# Altium project MB1144C.PrjPCB (part 4 of 4)
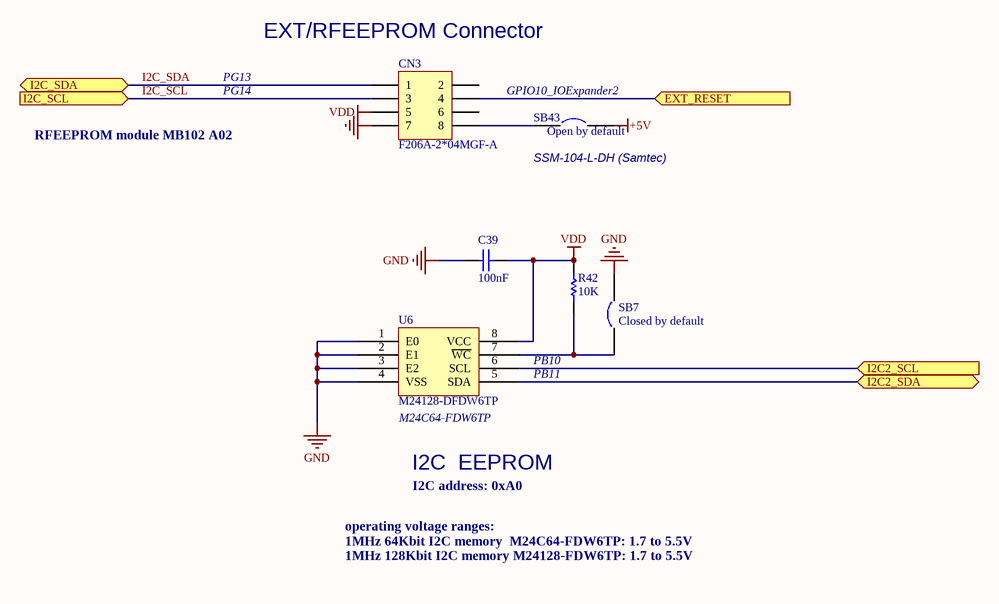
[diagram p25: RF_I2C_EEPROM.SchDoc]

## Nets that join several sheets
+1V8: Power (C107.1 TP16.1 U27.2 U27.4), Audio (6 pins)
+3V3: MotorControl (CN2.28 R14.2 R20.2), Extension connector (R44.1), USART_IrDA (10 pins), SWP_SmartCard_NFC (9 pins), USB_OTG_FS (R6.1 R8.1 R9.1), CAN (R70.1), peripherals (LD1.1 LD2.1 LD3.1 LD4.1), Power (9 pins), Audio (5 pins), LCD_TFT (9 pins)
+3V6: SRAM&Flash (C20.1 U5.G5), Power (5 pins)
+5V: MotorControl (CN2.25), ST_LINK (R169.2), SWP_SmartCard_NFC (C135.1 C138.1 U30.6), IDD_measurement (C75.1 R128.1 U15.4), USB_OTG_FS (U1.5), Power (11 pins), LCD_TFT (R223.1), RF_I2C_EEPROM (SB43.2)
D5V: Extension connector (CN6.28), ST_LINK (D7.1), Power (JP17.2)
E5V: ST_LINK (D5.1), Power (C100.1 JP17.8 L2.3)
GND: MCU (R100.2 R101.2 R102.2), LCD_Glass (R138.2 R139.2), IO_Expandor (10 pins), MCU2 (9 pins), SRAM&Flash (13 pins), MotorControl (26 pins), MicroSD (C90.2 CN18.6 CN18.9), QSPI (C44.2 U9.4), Extension connector (9 pins), JTAG&Trace (24 pins), ST_LINK (38 pins), USART_IrDA (19 pins), SWP_SmartCard_NFC (17 pins), STPMS2&PT100 (20 pins), IDD_measurement (12 pins), USB_OTG_FS (12 pins), Touch Sensing (C34.1 C37.1), CAN (10 pins), peripherals (9 pins), Power (60 pins), Audio (40 pins), LCD_TFT (27 pins), RF_I2C_EEPROM (7 pins)
U5V: ST_LINK (D6.1), USB_OTG_FS (R2.1), Power (JP17.6)
U5V_STLINK: ST_LINK (C143.2 U37.6 U37.7), Power (JP17.4)
VDD: LCD_Glass (R263.1 R264.1), IO_Expandor (9 pins), MCU2 (R57.2 R60.2 R96.2 SW1.1), SRAM&Flash (16 pins), MicroSD (7 pins), QSPI (C44.1 R74.1 U9.8), Extension connector (CN7.40), JTAG&Trace (8 pins), ST_LINK (8 pins), USART_IrDA (5 pins), SWP_SmartCard_NFC (C112.1 C119.1 U30.21), STPMS2&PT100 (5 pins), IDD_measurement (11 pins), CAN (C49.2 R46.2 U8.3), peripherals (10 pins), Power (JP2.2 JP12.1 TP5.1), Audio (6 pins), LCD_TFT (11 pins), RF_I2C_EEPROM (C39.2 CN3.5 R42.1 U6.8)
VDD_MCU: IDD_measurement (JP11.2 JP11.3), Power (21 pins)
VDDA: peripherals (CN10.2), Power (5 pins)
A0: MCU2 (U7.10), SRAM&Flash (U2.A3 U5.E2), Extension connector (CN6.25), LCD_TFT (U21.47)
A1: MCU2 (U7.11), SRAM&Flash (U2.A4 U5.D2), Extension connector (CN6.26), LCD_TFT (SB51.1 U21.37)
A2: MCU2 (U7.12), SRAM&Flash (U2.A5 U5.C2), Extension connector (CN6.32)
A3: MCU2 (U7.13), SRAM&Flash (U2.B3 U5.A2), Extension connector (CN6.34)
A4: MCU2 (U7.14), SRAM&Flash (U2.B4 U5.B2), Extension connector (CN6.37)
A5: MCU2 (U7.15), SRAM&Flash (U2.C3 U5.D3), Extension connector (CN6.38)
A6: MCU2 (U7.50), SRAM&Flash (U2.C4 U5.C3), Extension connector (CN7.17)
A7: MCU2 (U7.53), SRAM&Flash (U2.D4 U5.A3), Extension connector (CN7.18)
A8: MCU2 (U7.54), SRAM&Flash (U2.H2 U5.B6), Extension connector (CN7.16)
A9: MCU2 (U7.55), SRAM&Flash (U2.H3 U5.A6), Extension connector (CN7.14)
A10: MCU2 (U7.56), SRAM&Flash (U2.H4 U5.C6), Extension connector (CN7.12)
A11: MCU2 (U7.57), SRAM&Flash (U2.H5 U5.D6), Extension connector (CN7.11)
A12: MCU2 (U7.87), SRAM&Flash (U2.G3 U5.B7), Extension connector (CN6.13)
A13: MCU2 (U7.88), SRAM&Flash (U2.G4 U5.A7), Extension connector (CN6.12)
A14: MCU2 (U7.89), SRAM&Flash (U2.F3 U5.C7), Extension connector (CN6.14)
A15: MCU2 (U7.90), SRAM&Flash (U2.F4 U5.D7), Extension connector (CN6.10)
A16: LCD_Glass (CN14.30), SRAM&Flash (U2.E4 U5.E7)
A17: LCD_Glass (R151.1), SRAM&Flash (U2.D3 U5.B3)
A18: LCD_Glass (CN14.34), SRAM&Flash (U2.H1 U5.C4)
A19: LCD_Glass (R139.1 R150.1), SRAM&Flash (U2.G2 U5.D5)
A20: MCU (R84.1 R100.1), SRAM&Flash (U2.H6 U5.D4)
A21: MCU (R85.1 R101.1), SRAM&Flash (U2.E3 U5.C5)
A22: MCU (R86.1 R102.1), SRAM&Flash (U5.B8)
A23: LCD_Glass (R138.1 R149.1), SRAM&Flash (U5.C8)
BOOT0: MCU2 (JP8.1 R67.1 U7.138), Extension connector (CN7.20)
Comp2_INP: LCD_Glass (CN11.44), peripherals (JP7.3)
Comp2_OUT: LCD_Glass (CN11.14), peripherals (TP6.1)
D0: LCD_Glass (CN14.36), SRAM&Flash (U2.B6 U5.E3), LCD_TFT (U22.26)
D1: LCD_Glass (CN14.38), SRAM&Flash (U2.C5 U5.H3), LCD_TFT (U22.27)
D2: MCU (U7.114), SRAM&Flash (U2.C6 U5.E4), Extension connector (CN6.17), LCD_TFT (U22.29)
D3: MCU (U7.115), SRAM&Flash (U2.D5 U5.H4), Extension connector (CN6.16), LCD_TFT (U22.30)
D4: MCU (U7.58), SRAM&Flash (U2.E5 U5.H5), Extension connector (CN7.10), LCD_TFT (U22.32)
D5: MCU (U7.59), SRAM&Flash (U2.F5 U5.E5), Extension connector (CN7.9), LCD_TFT (U22.33)
D6: MCU (U7.60), SRAM&Flash (U2.F6 U5.H6), Extension connector (CN7.8), LCD_TFT (U22.35)
D7: MCU (U7.63), SRAM&Flash (U2.G6 U5.E6), Extension connector (CN7.7), LCD_TFT (U22.36)
D8: MCU (U7.64), SRAM&Flash (U2.B1 U5.F3), Extension connector (CN7.6), LCD_TFT (U22.37)
D9: MCU (U7.65), SRAM&Flash (U2.C1 U5.G3), Extension connector (CN7.5), LCD_TFT (U22.38)
D10: MCU (U7.66), SRAM&Flash (U2.C2 U5.F4), Extension connector (CN7.4), LCD_TFT (U22.40)
D11: MCU (U7.67), SRAM&Flash (U2.D2 U5.G4), Extension connector (CN7.3), LCD_TFT (U22.41)
D12: MCU (U7.68), SRAM&Flash (U2.E2 U5.F5), Extension connector (CN7.2), LCD_TFT (U22.43)
D13: LCD_Glass (CN14.24), SRAM&Flash (U2.F2 U5.G6), LCD_TFT (U22.44)
D14: LCD_Glass (CN14.26), SRAM&Flash (U2.F1 U5.F6), LCD_TFT (U22.46)
D15: LCD_Glass (CN14.28), SRAM&Flash (U2.G1 U5.G7), LCD_TFT (U22.47)
I2C_SCL: IO_Expandor (U32.4 U33.19), MCU2 (R60.1 R61.1), Audio (U29.H1), RF_I2C_EEPROM (CN3.3)
I2C_SDA: IO_Expandor (U32.5 U33.20), MCU2 (R57.1 R58.1), Audio (U29.F3), RF_I2C_EEPROM (CN3.1)
LCD_NE3: MCU2 (U7.125), Extension connector (CN6.21), LCD_TFT (SB49.1 U21.46)
LCDCOM0: MCU (U7.100), LCD_Glass (CN11.3)
LCDCOM1: MCU (U7.101), LCD_Glass (CN11.1)
LCDCOM2: MCU (U7.102), LCD_Glass (CN11.5)
LCDCOM3: MCU (U7.140), LCD_Glass (CN11.7)
LCDCOM4: LCD_Glass (CN14.7), MCU2 (U7.111)
LCDCOM5: LCD_Glass (CN14.5), MCU2 (U7.112)
LCDCOM6: LCD_Glass (CN14.3), MCU2 (U7.113)
LCDCOM7: MCU (U7.116), LCD_Glass (CN14.1)
LCDSEG0: MCU (R82.1), LCD_Glass (CN14.47)
LCDSEG1: MCU (R81.1), LCD_Glass (CN11.35)
LCDSEG2: MCU (R78.2), LCD_Glass (CN11.33)
LCDSEG3: MCU (R68.1), LCD_Glass (CN11.41)
LCDSEG4: MCU (R66.1), LCD_Glass (CN11.39)
LCDSEG5: MCU (R62.1), LCD_Glass (CN11.37)
LCDSEG6: MCU (R56.1), LCD_Glass (CN11.47)
LCDSEG7: MCU (U7.133), LCD_Glass (CN11.45), JTAG&Trace (RS1.9), ST_LINK (U24.6)
LCDSEG8: MCU (U7.134), LCD_Glass (CN11.43), JTAG&Trace (RS1.5), ST_LINK (U23.19)
LCDSEG9: MCU (U7.135), LCD_Glass (CN11.13)
LCDSEG10: MCU (R50.1), LCD_Glass (CN11.11)
LCDSEG11: MCU (R48.1), LCD_Glass (CN11.9)
LCDSEG12: MCU (R39.2), LCD_Glass (CN11.19)
LCDSEG13: MCU (R38.1), LCD_Glass (CN11.17)
LCDSEG14: MCU (U7.75), LCD_Glass (CN11.15)
LCDSEG15: MCU (U7.76), LCD_Glass (CN11.25)
LCDSEG16: MCU (U7.139), LCD_Glass (CN11.23)
LCDSEG17: MCU (U7.110), LCD_Glass (CN11.21), JTAG&Trace (RS1.7), ST_LINK (U23.17)
LCDSEG18: LCD_Glass (CN11.31), MCU2 (R97.1)
LCDSEG19: LCD_Glass (CN11.29), MCU2 (R98.1)
LCDSEG20: LCD_Glass (CN11.27), MCU2 (R99.1)
LCDSEG21: MCU (U7.137), LCD_Glass (CN14.9)
LCDSEG22: LCD_Glass (CN14.11), MCU2 (R65.1)
LCDSEG23: LCD_Glass (CN14.13), MCU2 (R64.1)
LCDSEG24: LCD_Glass (CN14.15), MCU2 (R36.1)
LCDSEG25: LCD_Glass (CN14.17), MCU2 (R33.1)
LCDSEG26: LCD_Glass (CN14.19), MCU2 (SB28.2 U7.98)
LCDSEG27: LCD_Glass (CN14.21), MCU2 (SB29.2 U7.99)
LCDSEG28: MCU (U7.77), LCD_Glass (CN14.23)
LCDSEG29: MCU (U7.78), LCD_Glass (CN14.25)
LCDSEG30: MCU (U7.79), LCD_Glass (CN14.27)
LCDSEG31: MCU (U7.80), LCD_Glass (CN14.29)
LCDSEG32: MCU (U7.81), LCD_Glass (CN14.31)
LCDSEG33: MCU (U7.82), LCD_Glass (CN14.33)
LCDSEG34: MCU (U7.85), LCD_Glass (CN14.35)
LCDSEG35: MCU (U7.86), LCD_Glass (CN14.37)
LCDSEG36: MCU (U7.141), LCD_Glass (CN14.39)
LCDSEG37: MCU (U7.142), LCD_Glass (CN14.41)
LCDSEG38: MCU (R103.2), LCD_Glass (CN14.43)
LCDSEG39: MCU (R104.2), LCD_Glass (CN14.45)
NetB3_1: IO_Expandor (U33.3), peripherals (B3.1 R248.1)
NetB3_2: IO_Expandor (U33.1), peripherals (B3.2 R246.2)
NetB3_3: IO_Expandor (U33.2), peripherals (B3.3 R247.1)
NetB3_4: IO_Expandor (U33.4), peripherals (B3.4 R249.1)
NetB3_6: IO_Expandor (U33.5), peripherals (B3.6 R250.1)
NetC1_2: MCU (SB32.1), MotorControl (C1.2 CN2.33)
NetC2_2: MCU (SB31.1), MotorControl (C2.2 CN2.34)
NetC3_1: MCU2 (SB17.1), MotorControl (C3.1 R7.2)
NetC4_2: MCU (SB35.1), MotorControl (C4.2 CN2.31 SB1.2)
NetC5_2: MCU (SB3.1), MotorControl (C5.2 CN2.30 R20.1)
NetC6_2: MCU (SB20.1), MotorControl (C6.2 R12.2)
NetC7_2: MCU2 (SB29.1), MotorControl (C7.2 CN2.1 R14.1)
NetC9_2: MCU2 (SB37.2), MotorControl (C9.2 CN2.29)
NetC10_2: MCU2 (SB42.1), MotorControl (C10.2 R17.1)
NetC11_1: MCU2 (SB16.1), MotorControl (C11.1 R13.2 R19.1)
NetC13_2: MCU2 (SB36.1), MotorControl (C13.2 R10.1)
NetC14_2: MCU2 (SB34.1), MotorControl (C14.2 R11.1)
NetC15_1: LCD_Glass (CN11.2 R108.2), USB_OTG_FS (6 pins)
NetC16_2: MCU2 (SB25.2), MotorControl (C16.2 R15.1)
NetC17_1: MCU (SB22.1), MotorControl (C17.1 R16.2)
NetC34_2: MCU2 (SB4.1), Touch Sensing (C34.2)
NetC37_2: MCU (SB6.1), Touch Sensing (C37.2)
NetC52_2: peripherals (C52.2 C53.1 R92.2), Power (U7.32)
NetC73_1: MCU (R69.2), IDD_measurement (C73.1 R122.2)
NetCN2_3: MCU2 (SB27.1), MotorControl (CN2.3)
NetCN2_5: MCU (SB19.1), MotorControl (CN2.5)
NetCN2_7: MCU2 (SB30.1), MotorControl (CN2.7)
NetCN2_9: MCU (SB15.1), MotorControl (CN2.9)
NetCN2_11: MCU2 (SB28.1), MotorControl (CN2.11)
NetCN2_13: MCU (SB13.1), MotorControl (CN2.13)
NetCN2_21: MCU2 (SB5.2), MotorControl (CN2.21)
NetCN2_23: MCU (SB11.1), MotorControl (CN2.23)
NetCN3_4: IO_Expandor (U33.12), RF_I2C_EEPROM (CN3.4)
NetCN11_4: LCD_Glass (CN11.4), MicroSD (R194.1)
NetCN11_6: LCD_Glass (CN11.6), USB_OTG_FS (R5.2)
NetCN11_8: LCD_Glass (CN11.8), CAN (R75.2)
NetCN11_16: LCD_Glass (CN11.16), SWP_SmartCard_NFC (CN13.4)
NetCN11_18: LCD_Glass (CN11.18 R108.1), SWP_SmartCard_NFC (CN13.6)
NetCN11_20: LCD_Glass (CN11.20 R109.1), SWP_SmartCard_NFC (CN23.6)
NetCN11_24: LCD_Glass (CN11.24), CAN (R76.1)
NetCN11_26: LCD_Glass (CN11.26), SWP_SmartCard_NFC (CN13.5)
NetCN11_28: LCD_Glass (CN11.28), STPMS2&PT100 (6 pins), Audio (JP14.3)
NetCN11_30: LCD_Glass (CN11.30), peripherals (R256.1)
NetCN11_32: LCD_Glass (CN11.32), Audio (U29.A9 U35.4 U36.4)
NetCN12_12: MCU (SB26.2), JTAG&Trace (CN12.12 U18.4)
NetCN12_18: MCU (SB38.2), JTAG&Trace (CN12.18 U19.3)
NetCN12_20: MCU (SB39.2), JTAG&Trace (CN12.20 U19.1)
NetCN13_1: USART_IrDA (JP15.6), SWP_SmartCard_NFC (CN13.1)
NetCN13_2: USART_IrDA (U10.13 U11.3 U12.7), SWP_SmartCard_NFC (CN13.2)
NetCN14_2: LCD_Glass (CN14.2), MicroSD (CN18.3 R178.2)
NetCN14_10: LCD_Glass (CN14.10), USART_IrDA (JP15.1 JP15.3 JP15.5 R158.1)
NetCN14_40: LCD_Glass (CN14.40), SRAM&Flash (U2.A1)
NetCN14_42: LCD_Glass (CN14.42), SRAM&Flash (U2.B2)
NetCN18_1: LCD_Glass (R142.1), MicroSD (CN18.1 R175.2)
NetCN18_2: LCD_Glass (R141.1), MicroSD (CN18.2 R176.2)
NetCN18_5: LCD_Glass (R140.1), MicroSD (CN18.5)
NetCN18_7: LCD_Glass (R147.1), MicroSD (CN18.7 R182.2)
NetCN18_8: LCD_Glass (R148.1), MicroSD (CN18.8 R185.2)
NetCN19_31: IO_Expandor (U32.16), LCD_TFT (CN19.31)
NetCN19_32: IO_Expandor (U32.13), LCD_TFT (CN19.32)
NetCN19_33: IO_Expandor (U32.1), LCD_TFT (CN19.33)
NetCN19_34: IO_Expandor (U32.15), LCD_TFT (CN19.34)
NetD4_2: MCU2 (D4.2), USART_IrDA (R93.1 U10.16)
NetJP19_1: LCD_Glass (R145.1), USB_OTG_FS (JP19.1)
NetLD6_2: LCD_Glass (R109.2), USB_OTG_FS (LD6.2 R8.2 U1.3)
NetR24_1: LCD_Glass (R146.1), STPMS2&PT100 (R24.1)
NetR32_2: MCU (SB10.2), SRAM&Flash (R32.2 U5.A4)
NetR34_1: MCU2 (R34.1), ST_LINK (R189.1), USART_IrDA (R119.2)
NetR35_1: MCU2 (R35.1), Audio (R199.2)
NetR37_1: MCU2 (SB2.1), Touch Sensing (R37.1)
NetR39_1: MCU (R39.1 SB3.2 U7.73), Touch Sensing (R40.1)
NetR53_2: MCU (R53.2), Audio (R205.2)
NetR54_2: MCU (R54.2), peripherals (R258.1)
NetR59_2: MCU2 (R59.2), USART_IrDA (U10.20)
NetR71_2: MCU (SB8.1), QSPI (R71.2)
NetR89_1: MCU2 (R89.1), Audio (R201.2)
NetR90_1: MCU2 (R90.1), Audio (R208.2)
NetR91_1: MCU2 (R91.1), IDD_measurement (R127.2 U14.12)
NetR104_1: MCU (R104.1 U7.2), JTAG&Trace (R154.2)
NetR105_1: MCU2 (R105.1), Audio (R198.2)
NetR106_1: MCU2 (R106.1), Audio (R222.1)
NetR107_1: LCD_Glass (R107.1), SWP_SmartCard_NFC (U30.24)
NetR137_1: LCD_Glass (R144.1), IDD_measurement (5 pins)
NetR143_1: LCD_Glass (R143.1), SWP_SmartCard_NFC (R210.2)
NetR156_2: MCU (SB40.2), JTAG&Trace (R156.2)
NetR213_1: IO_Expandor (U33.10), SWP_SmartCard_NFC (R213.1 U30.23)
NetR214_2: IO_Expandor (U33.6), SWP_SmartCard_NFC (R214.2 U30.20)
NetR215_2: IO_Expandor (U33.7), SWP_SmartCard_NFC (R215.2 U30.19)
NetR241_1: IO_Expandor (U33.8), SWP_SmartCard_NFC (R241.1 U30.3)
NetR255_1: IO_Expandor (U32.11), peripherals (R255.1)
NetR257_1: IO_Expandor (U32.8), peripherals (R257.1)
NetR260_1: IO_Expandor (U33.11), LCD_TFT (R260.1)
NetR263_2: LCD_Glass (R263.2 R265.1), RF_I2C_EEPROM (U6.5)
NetR264_2: LCD_Glass (R264.2 R266.1), RF_I2C_EEPROM (U6.6)
NetSB9_1: MCU (SB9.1), QSPI (U9.6)
NetSB12_1: MCU (SB12.1), QSPI (U9.5)
NetSB14_1: MCU (SB14.1), QSPI (U9.2)
NetSB18_1: MCU (SB18.1), QSPI (U9.3)
NetSB21_1: MCU (SB21.1), QSPI (U9.7)
OpAmp1_INM: LCD_Glass (CN14.48), peripherals (R120.1 R121.2 RV2.1)
OpAmp1_INP: MCU (R83.2), peripherals (R63.2)
OpAmp1_OUT: LCD_Glass (R111.1), peripherals (RV2.2 RV2.3 TP9.1)
PA0: MCU (R83.1 SB35.2 U7.34), Extension connector (CN7.37)
PA4: MCU (U7.40), Extension connector (CN7.38), peripherals (R73.1)
PA5: MCU (R69.1 U7.41), Extension connector (CN7.35)
PA11: MCU (U7.103), Extension connector (CN6.6), USB_OTG_FS (D1.D3 R3.2)
PA12: MCU (U7.104), Extension connector (CN6.7), USB_OTG_FS (D1.C3 R4.2)
PA13: MCU (U7.105), Extension connector (CN6.5), JTAG&Trace (RS1.13), ST_LINK (U23.27 U24.7)
PA14: MCU (U7.109), Extension connector (CN6.8), JTAG&Trace (RS1.11), ST_LINK (U23.15 U23.26)
PB2: MCU (R54.1 SB11.2 U7.48), Extension connector (CN7.13)
PB6: MCU (U7.136), Extension connector (CN6.40), USART_IrDA (R118.2)
PC3: MCU2 (R94.1 U7.29), Extension connector (CN7.36)
PC13: MCU2 (U7.7), Extension connector (R80.2), peripherals (R244.2)
PC14: MCU2 (R87.2 U7.8), Extension connector (SB41.1)
PC15: MCU2 (R88.2 U7.9), Extension connector (SB33.1)
PD3: MCU (U7.117), Extension connector (CN6.15), STPMS2&PT100 (R23.1)
PD4: MCU (U7.118), SRAM&Flash (U2.A2 U5.G2), Extension connector (CN6.18), LCD_TFT (U21.43)
PD5: MCU (U7.119), SRAM&Flash (U2.G5 U5.A5), Extension connector (CN6.19), LCD_TFT (U21.44)
PD6: MCU (R53.1 SB10.1 U7.122), Extension connector (CN6.24)
PD7: MCU (U7.123), SRAM&Flash (R18.2), Extension connector (CN6.23)
PE4: MCU (R84.2 SB40.1 U7.3), Extension connector (CN7.21)
PE5: MCU (R85.2 SB38.1 U7.4), Extension connector (CN7.23)
PE6: MCU (R86.2 SB39.1 U7.5), Extension connector (CN7.22)
PF6: MCU2 (R105.2 U7.18), Extension connector (CN7.27)
PF7: MCU2 (R106.2 U7.19), Extension connector (CN7.28)
PF8: MCU2 (R89.2 U7.20), Extension connector (CN7.30)
PF9: MCU2 (R90.2 SB25.1 U7.21), Extension connector (CN7.29)
PF10: MCU2 (R91.2 SB37.1 U7.22), Extension connector (CN7.31)
PF11: MCU2 (U7.49), Extension connector (CN7.19), SWP_SmartCard_NFC (CN13.3)
PG6: MCU2 (R35.2 SB5.1 U7.91), Extension connector (CN6.3)
PG7: MCU2 (R34.2 U7.92), Extension connector (CN6.4)
PG8: MCU2 (U7.93), Extension connector (CN6.9), ST_LINK (R188.2), USART_IrDA (R158.2)
PG9: MCU2 (U7.124), SRAM&Flash (R43.2), Extension connector (CN6.20)
PG11: MCU2 (U7.126), Extension connector (CN6.27), USART_IrDA (R93.2)
PG12: MCU2 (U7.127), Extension connector (CN6.31), USART_IrDA (R116.2)
PG13: MCU2 (R58.2 U7.128), Extension connector (CN6.29)
PG14: MCU2 (R61.2 U7.129), Extension connector (CN6.33)
PG15: IO_Expandor (R228.1), MCU2 (U7.132), Extension connector (CN6.35)
PH0: MCU2 (C54.1 U7.23 X2.2), Extension connector (SB24.1)
PH1: MCU2 (R95.1 U7.24), Extension connector (SB23.1)
RESET#: MCU2 (6 pins), Extension connector (R79.1), JTAG&Trace (RS1.3), ST_LINK (U23.18), LCD_TFT (U21.41)